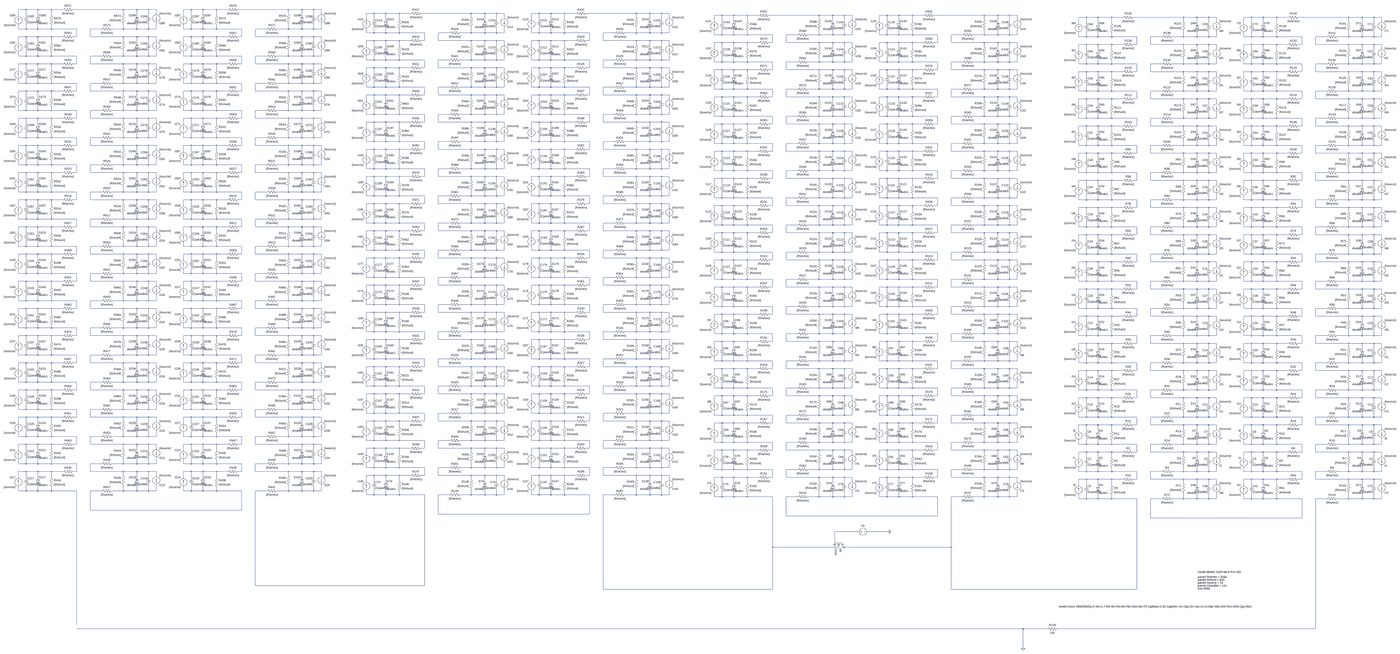
[diagram p0: schematic string-module-72cells-series.asc, whole sheet]
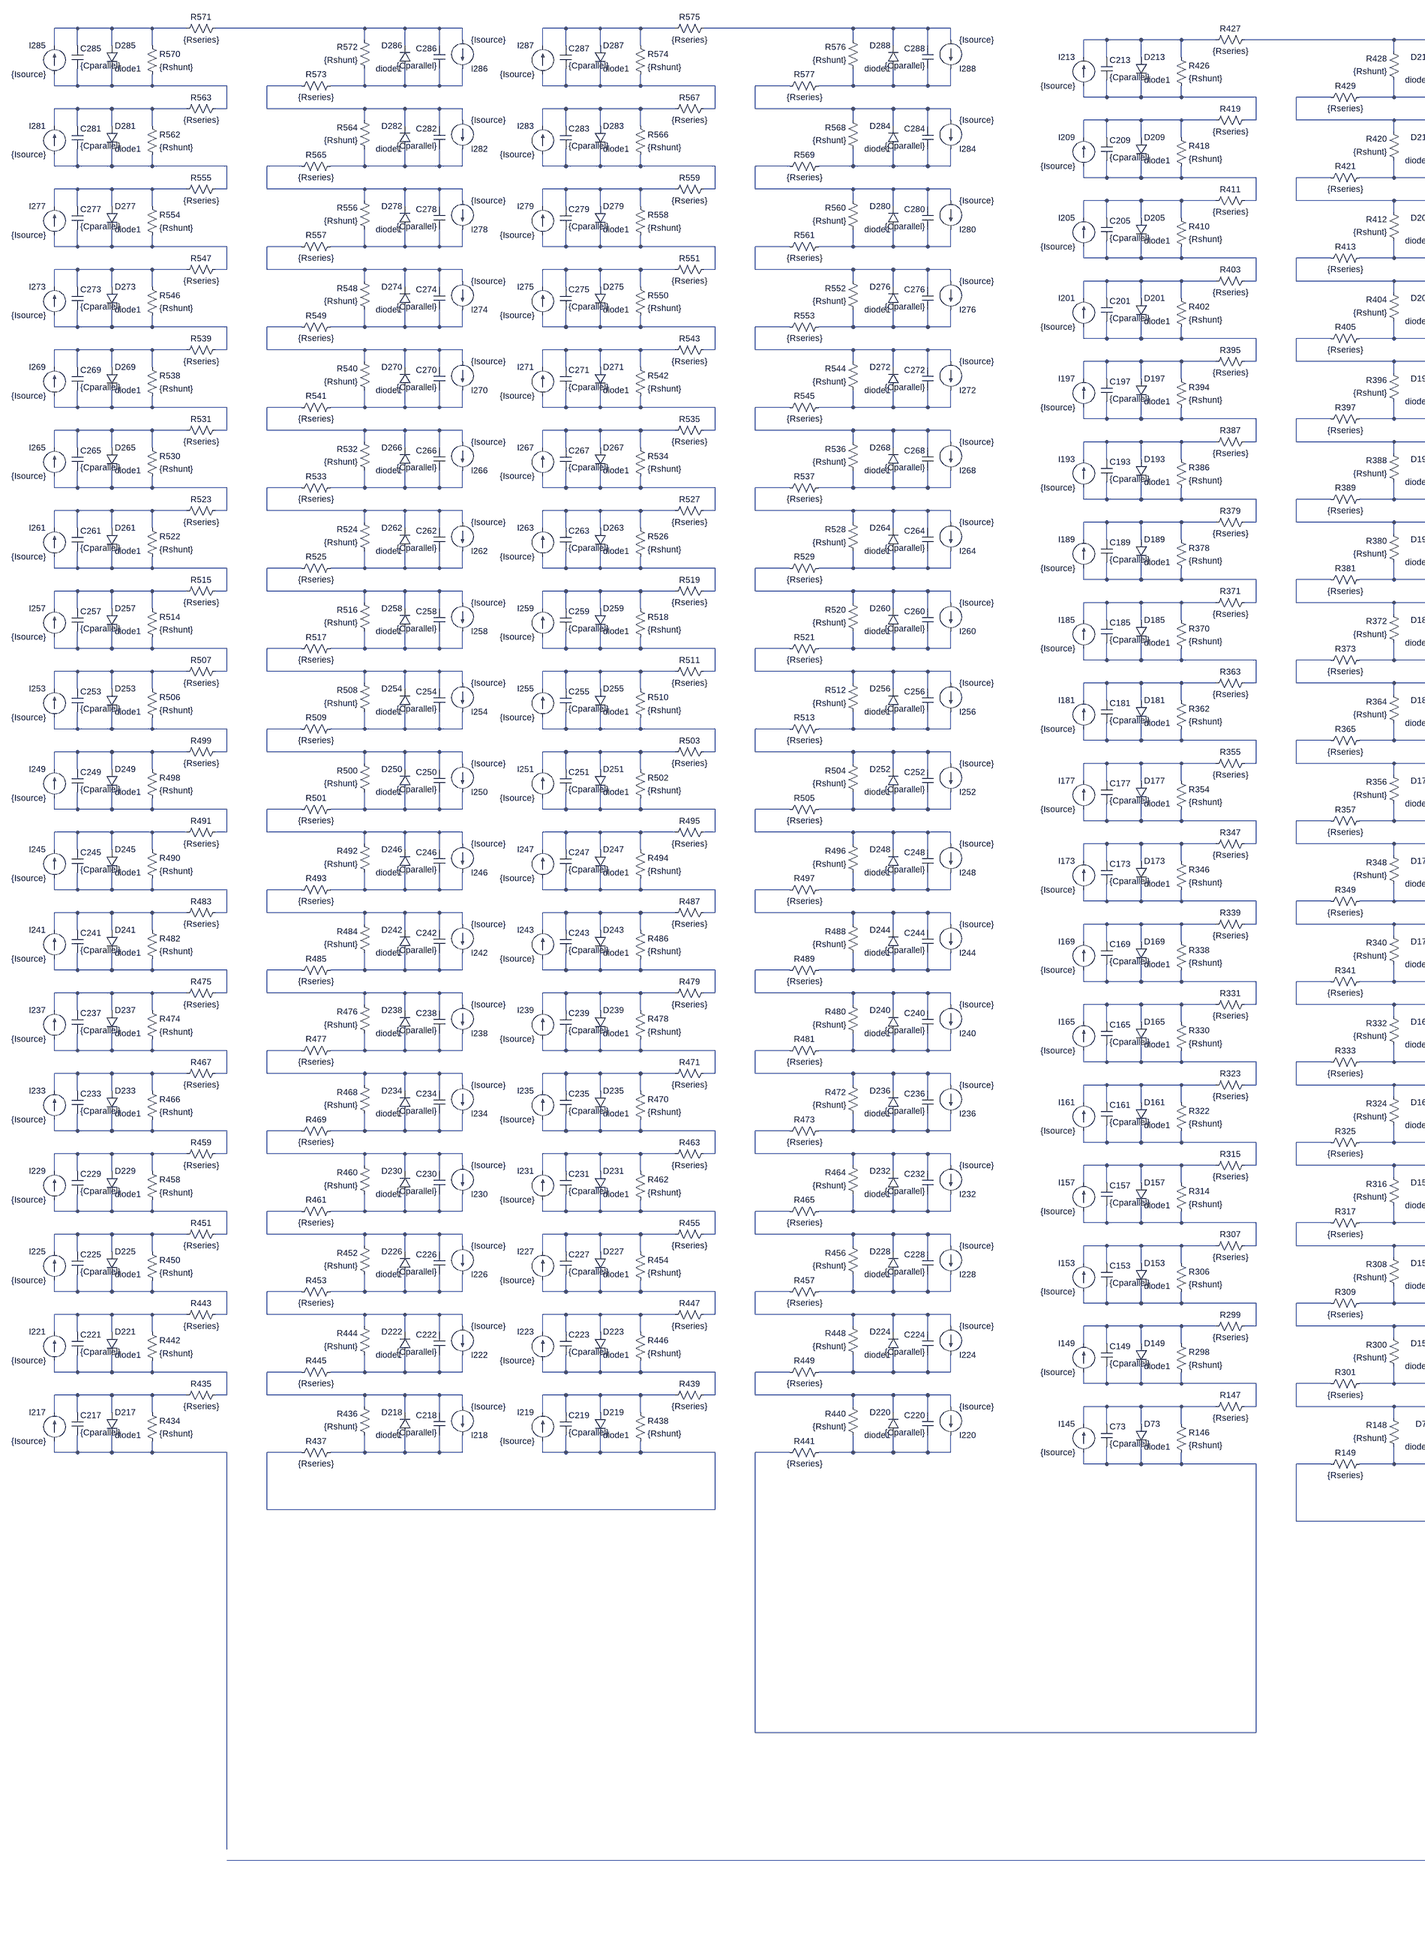
[diagram p1: schematic string-module-72cells-series.asc, part, row 1 of 1, column 1 of 3]
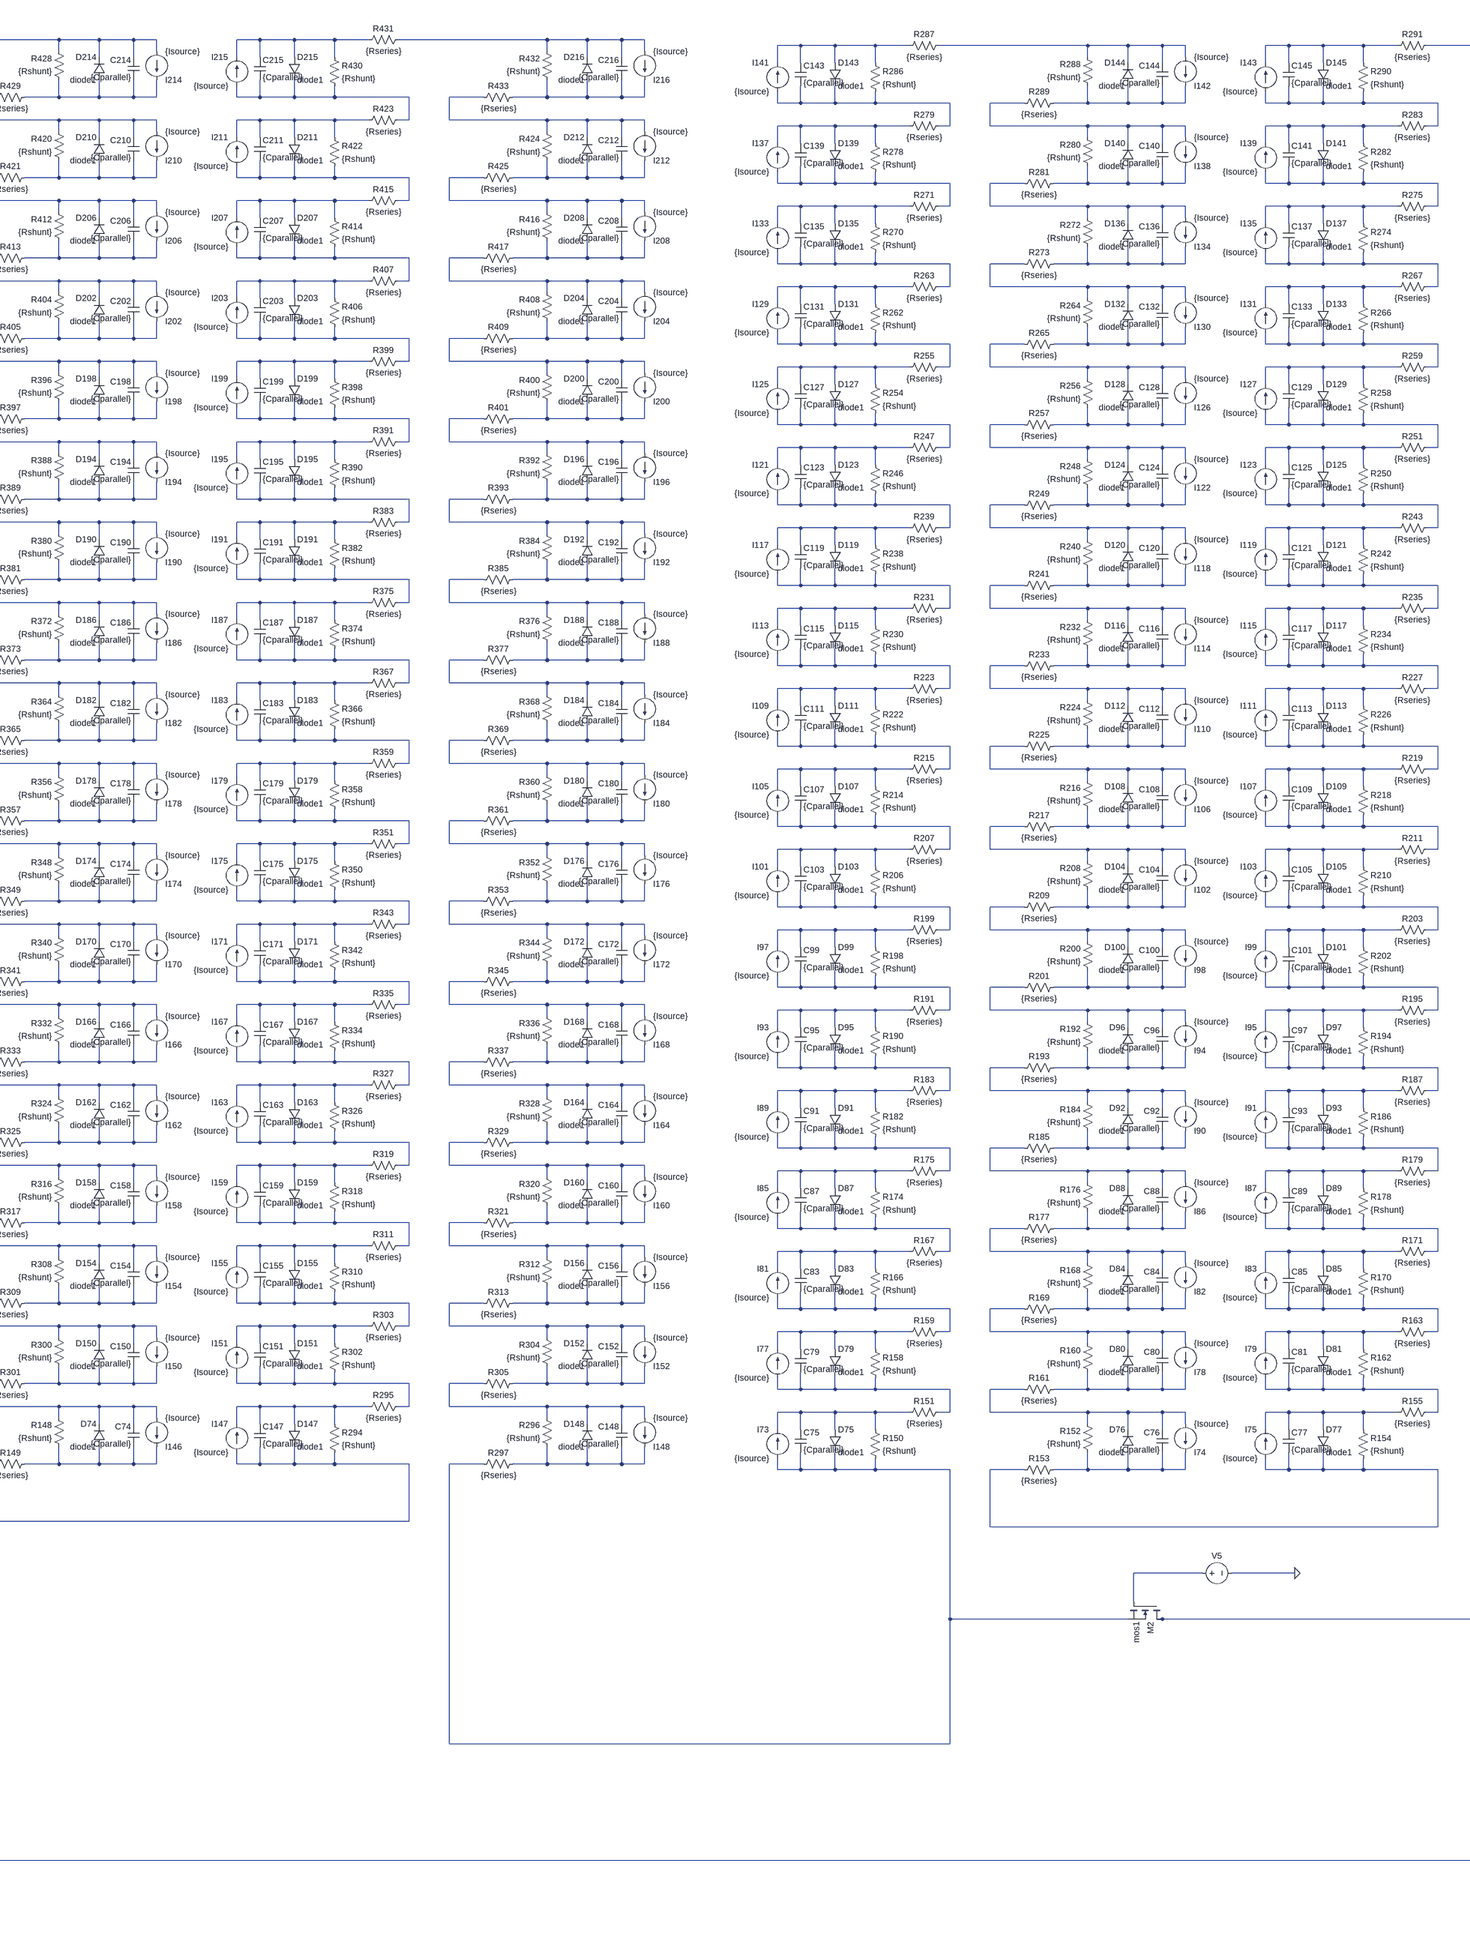
[diagram p2: schematic string-module-72cells-series.asc, part, row 1 of 1, column 2 of 3]
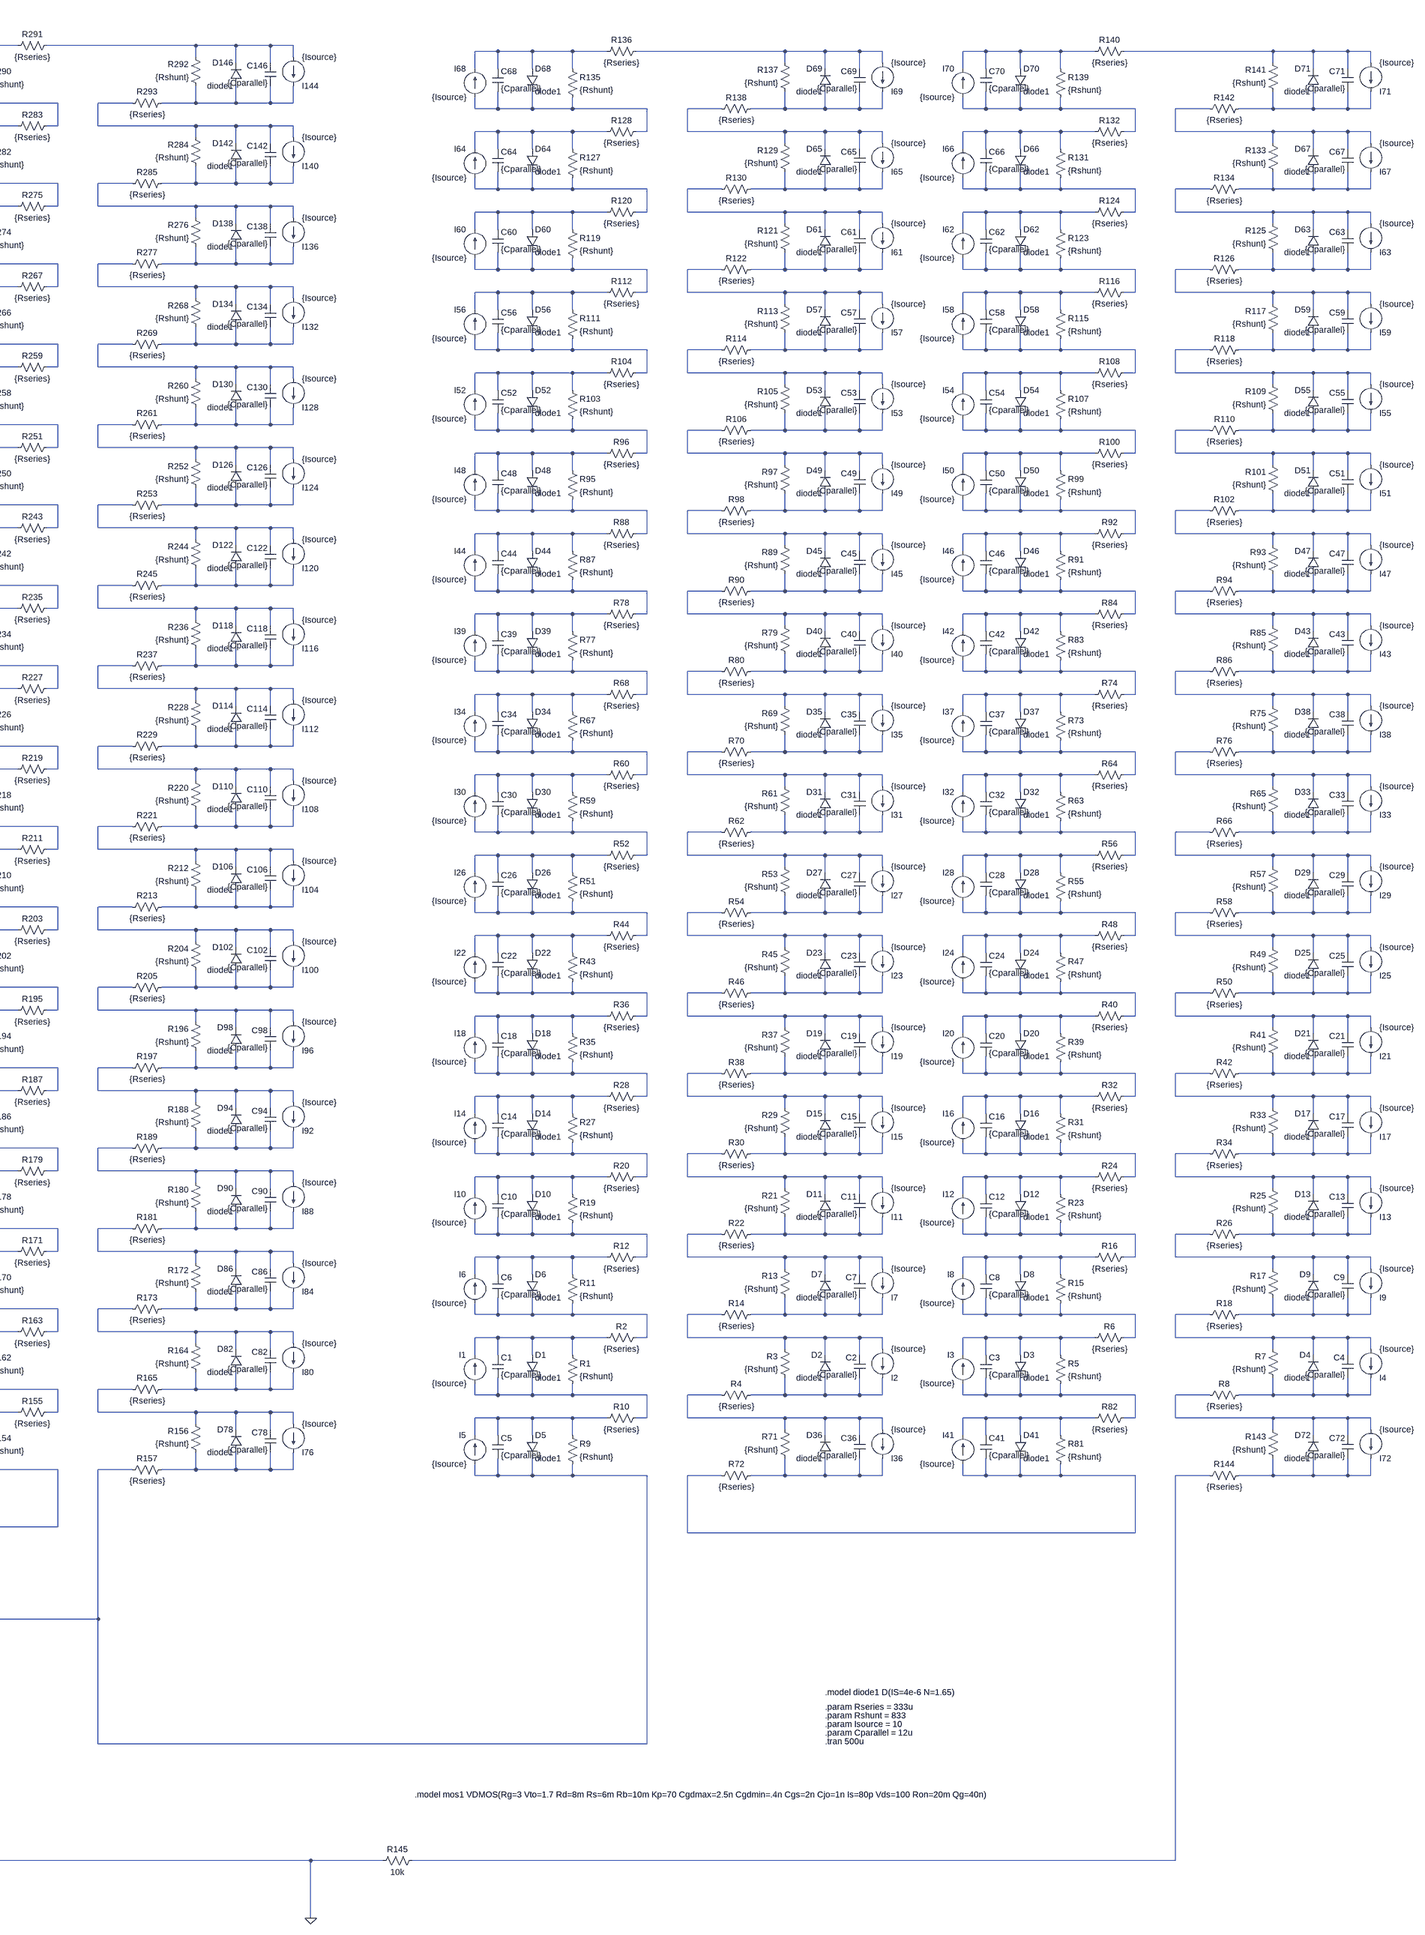
[diagram p3: schematic string-module-72cells-series.asc, part, row 1 of 1, column 3 of 3]
* string-module-72cells-series.asc
I5 N572 N559 {Isource}
C5 N559 N572 {Cparallel}
D5 N559 N572 diode1
R9 N559 N572 {Rshunt}
R10 N549 N559 {Rseries}
I36 N550 N575 {Isource}
C36 N575 N550 {Cparallel}
D36 N575 N550 diode1
R71 N575 N550 {Rshunt}
R72 N574 N575 {Rseries}
I41 N574 N560 {Isource}
C41 N560 N574 {Cparallel}
D41 N560 N574 diode1
R81 N560 N574 {Rshunt}
R82 N552 N560 {Rseries}
I72 N553 N577 {Isource}
C72 N577 N553 {Cparallel}
D72 N577 N553 diode1
R143 N577 N553 {Rshunt}
R144 N576 N577 {Rseries}
I1 N549 N527 {Isource}
C1 N527 N549 {Cparallel}
D1 N527 N549 diode1
R1 N527 N549 {Rshunt}
R2 N517 N527 {Rseries}
I2 N518 N551 {Isource}
C2 N551 N518 {Cparallel}
D2 N551 N518 diode1
R3 N551 N518 {Rshunt}
R4 N550 N551 {Rseries}
I3 N552 N528 {Isource}
C3 N528 N552 {Cparallel}
D3 N528 N552 diode1
R5 N528 N552 {Rshunt}
R6 N520 N528 {Rseries}
I4 N521 N554 {Isource}
C4 N554 N521 {Cparallel}
D4 N554 N521 diode1
R7 N554 N521 {Rshunt}
R8 N553 N554 {Rseries}
I6 N517 N495 {Isource}
C6 N495 N517 {Cparallel}
D6 N495 N517 diode1
R11 N495 N517 {Rshunt}
R12 N485 N495 {Rseries}
I7 N486 N519 {Isource}
C7 N519 N486 {Cparallel}
D7 N519 N486 diode1
R13 N519 N486 {Rshunt}
R14 N518 N519 {Rseries}
I8 N520 N496 {Isource}
C8 N496 N520 {Cparallel}
D8 N496 N520 diode1
R15 N496 N520 {Rshunt}
R16 N488 N496 {Rseries}
I9 N489 N522 {Isource}
C9 N522 N489 {Cparallel}
D9 N522 N489 diode1
R17 N522 N489 {Rshunt}
R18 N521 N522 {Rseries}
I10 N485 N463 {Isource}
C10 N463 N485 {Cparallel}
D10 N463 N485 diode1
R19 N463 N485 {Rshunt}
R20 N453 N463 {Rseries}
I11 N454 N487 {Isource}
C11 N487 N454 {Cparallel}
D11 N487 N454 diode1
R21 N487 N454 {Rshunt}
R22 N486 N487 {Rseries}
I12 N488 N464 {Isource}
C12 N464 N488 {Cparallel}
D12 N464 N488 diode1
R23 N464 N488 {Rshunt}
R24 N456 N464 {Rseries}
I13 N457 N490 {Isource}
C13 N490 N457 {Cparallel}
D13 N490 N457 diode1
R25 N490 N457 {Rshunt}
R26 N489 N490 {Rseries}
I14 N453 N431 {Isource}
C14 N431 N453 {Cparallel}
D14 N431 N453 diode1
R27 N431 N453 {Rshunt}
R28 N421 N431 {Rseries}
I15 N422 N455 {Isource}
C15 N455 N422 {Cparallel}
D15 N455 N422 diode1
R29 N455 N422 {Rshunt}
R30 N454 N455 {Rseries}
I16 N456 N432 {Isource}
C16 N432 N456 {Cparallel}
D16 N432 N456 diode1
R31 N432 N456 {Rshunt}
R32 N424 N432 {Rseries}
I17 N425 N458 {Isource}
C17 N458 N425 {Cparallel}
D17 N458 N425 diode1
R33 N458 N425 {Rshunt}
R34 N457 N458 {Rseries}
I18 N421 N399 {Isource}
C18 N399 N421 {Cparallel}
D18 N399 N421 diode1
R35 N399 N421 {Rshunt}
R36 N389 N399 {Rseries}
I19 N390 N423 {Isource}
C19 N423 N390 {Cparallel}
D19 N423 N390 diode1
R37 N423 N390 {Rshunt}
R38 N422 N423 {Rseries}
I20 N424 N400 {Isource}
C20 N400 N424 {Cparallel}
D20 N400 N424 diode1
R39 N400 N424 {Rshunt}
R40 N392 N400 {Rseries}
I21 N393 N426 {Isource}
C21 N426 N393 {Cparallel}
D21 N426 N393 diode1
R41 N426 N393 {Rshunt}
R42 N425 N426 {Rseries}
I22 N389 N367 {Isource}
C22 N367 N389 {Cparallel}
D22 N367 N389 diode1
R43 N367 N389 {Rshunt}
R44 N357 N367 {Rseries}
I23 N358 N391 {Isource}
C23 N391 N358 {Cparallel}
D23 N391 N358 diode1
R45 N391 N358 {Rshunt}
R46 N390 N391 {Rseries}
I24 N392 N368 {Isource}
C24 N368 N392 {Cparallel}
D24 N368 N392 diode1
R47 N368 N392 {Rshunt}
R48 N360 N368 {Rseries}
I25 N361 N394 {Isource}
C25 N394 N361 {Cparallel}
D25 N394 N361 diode1
R49 N394 N361 {Rshunt}
R50 N393 N394 {Rseries}
I26 N357 N335 {Isource}
C26 N335 N357 {Cparallel}
D26 N335 N357 diode1
R51 N335 N357 {Rshunt}
R52 N325 N335 {Rseries}
I27 N326 N359 {Isource}
C27 N359 N326 {Cparallel}
D27 N359 N326 diode1
R53 N359 N326 {Rshunt}
R54 N358 N359 {Rseries}
I28 N360 N336 {Isource}
C28 N336 N360 {Cparallel}
D28 N336 N360 diode1
R55 N336 N360 {Rshunt}
R56 N328 N336 {Rseries}
I29 N329 N362 {Isource}
C29 N362 N329 {Cparallel}
D29 N362 N329 diode1
R57 N362 N329 {Rshunt}
R58 N361 N362 {Rseries}
I30 N325 N303 {Isource}
C30 N303 N325 {Cparallel}
D30 N303 N325 diode1
R59 N303 N325 {Rshunt}
R60 N293 N303 {Rseries}
I31 N294 N327 {Isource}
C31 N327 N294 {Cparallel}
D31 N327 N294 diode1
R61 N327 N294 {Rshunt}
R62 N326 N327 {Rseries}
I32 N328 N304 {Isource}
C32 N304 N328 {Cparallel}
D32 N304 N328 diode1
R63 N304 N328 {Rshunt}
R64 N296 N304 {Rseries}
I33 N297 N330 {Isource}
C33 N330 N297 {Cparallel}
D33 N330 N297 diode1
R65 N330 N297 {Rshunt}
R66 N329 N330 {Rseries}
I34 N293 N271 {Isource}
C34 N271 N293 {Cparallel}
D34 N271 N293 diode1
R67 N271 N293 {Rshunt}
R68 N261 N271 {Rseries}
I35 N262 N295 {Isource}
C35 N295 N262 {Cparallel}
D35 N295 N262 diode1
R69 N295 N262 {Rshunt}
R70 N294 N295 {Rseries}
I37 N296 N272 {Isource}
C37 N272 N296 {Cparallel}
D37 N272 N296 diode1
R73 N272 N296 {Rshunt}
R74 N264 N272 {Rseries}
I38 N265 N298 {Isource}
C38 N298 N265 {Cparallel}
D38 N298 N265 diode1
R75 N298 N265 {Rshunt}
R76 N297 N298 {Rseries}
I39 N261 N239 {Isource}
C39 N239 N261 {Cparallel}
D39 N239 N261 diode1
R77 N239 N261 {Rshunt}
R78 N229 N239 {Rseries}
I40 N230 N263 {Isource}
C40 N263 N230 {Cparallel}
D40 N263 N230 diode1
R79 N263 N230 {Rshunt}
R80 N262 N263 {Rseries}
I42 N264 N240 {Isource}
C42 N240 N264 {Cparallel}
D42 N240 N264 diode1
R83 N240 N264 {Rshunt}
R84 N232 N240 {Rseries}
I43 N233 N266 {Isource}
C43 N266 N233 {Cparallel}
D43 N266 N233 diode1
R85 N266 N233 {Rshunt}
R86 N265 N266 {Rseries}
I44 N229 N207 {Isource}
C44 N207 N229 {Cparallel}
D44 N207 N229 diode1
R87 N207 N229 {Rshunt}
R88 N197 N207 {Rseries}
I45 N198 N231 {Isource}
C45 N231 N198 {Cparallel}
D45 N231 N198 diode1
R89 N231 N198 {Rshunt}
R90 N230 N231 {Rseries}
I46 N232 N208 {Isource}
C46 N208 N232 {Cparallel}
D46 N208 N232 diode1
R91 N208 N232 {Rshunt}
R92 N200 N208 {Rseries}
I47 N201 N234 {Isource}
C47 N234 N201 {Cparallel}
D47 N234 N201 diode1
R93 N234 N201 {Rshunt}
R94 N233 N234 {Rseries}
I48 N197 N175 {Isource}
C48 N175 N197 {Cparallel}
D48 N175 N197 diode1
R95 N175 N197 {Rshunt}
R96 N165 N175 {Rseries}
I49 N166 N199 {Isource}
C49 N199 N166 {Cparallel}
D49 N199 N166 diode1
R97 N199 N166 {Rshunt}
R98 N198 N199 {Rseries}
I50 N200 N176 {Isource}
C50 N176 N200 {Cparallel}
D50 N176 N200 diode1
R99 N176 N200 {Rshunt}
R100 N168 N176 {Rseries}
I51 N169 N202 {Isource}
C51 N202 N169 {Cparallel}
D51 N202 N169 diode1
R101 N202 N169 {Rshunt}
R102 N201 N202 {Rseries}
I52 N165 N143 {Isource}
C52 N143 N165 {Cparallel}
D52 N143 N165 diode1
R103 N143 N165 {Rshunt}
R104 N133 N143 {Rseries}
I53 N134 N167 {Isource}
C53 N167 N134 {Cparallel}
D53 N167 N134 diode1
R105 N167 N134 {Rshunt}
R106 N166 N167 {Rseries}
I54 N168 N144 {Isource}
C54 N144 N168 {Cparallel}
D54 N144 N168 diode1
R107 N144 N168 {Rshunt}
R108 N136 N144 {Rseries}
I55 N137 N170 {Isource}
C55 N170 N137 {Cparallel}
D55 N170 N137 diode1
R109 N170 N137 {Rshunt}
R110 N169 N170 {Rseries}
I56 N133 N111 {Isource}
C56 N111 N133 {Cparallel}
D56 N111 N133 diode1
R111 N111 N133 {Rshunt}
R112 N101 N111 {Rseries}
I57 N102 N135 {Isource}
C57 N135 N102 {Cparallel}
D57 N135 N102 diode1
R113 N135 N102 {Rshunt}
R114 N134 N135 {Rseries}
I58 N136 N112 {Isource}
C58 N112 N136 {Cparallel}
D58 N112 N136 diode1
R115 N112 N136 {Rshunt}
R116 N104 N112 {Rseries}
I59 N105 N138 {Isource}
C59 N138 N105 {Cparallel}
D59 N138 N105 diode1
R117 N138 N105 {Rshunt}
R118 N137 N138 {Rseries}
I60 N101 N079 {Isource}
C60 N079 N101 {Cparallel}
D60 N079 N101 diode1
R119 N079 N101 {Rshunt}
R120 N069 N079 {Rseries}
I61 N070 N103 {Isource}
C61 N103 N070 {Cparallel}
D61 N103 N070 diode1
R121 N103 N070 {Rshunt}
R122 N102 N103 {Rseries}
I62 N104 N080 {Isource}
C62 N080 N104 {Cparallel}
D62 N080 N104 diode1
R123 N080 N104 {Rshunt}
R124 N072 N080 {Rseries}
I63 N073 N106 {Isource}
C63 N106 N073 {Cparallel}
D63 N106 N073 diode1
R125 N106 N073 {Rshunt}
R126 N105 N106 {Rseries}
I64 N069 N047 {Isource}
C64 N047 N069 {Cparallel}
D64 N047 N069 diode1
R127 N047 N069 {Rshunt}
R128 N037 N047 {Rseries}
I65 N038 N071 {Isource}
C65 N071 N038 {Cparallel}
D65 N071 N038 diode1
R129 N071 N038 {Rshunt}
R130 N070 N071 {Rseries}
I66 N072 N048 {Isource}
C66 N048 N072 {Cparallel}
D66 N048 N072 diode1
R131 N048 N072 {Rshunt}
R132 N040 N048 {Rseries}
I67 N041 N074 {Isource}
C67 N074 N041 {Cparallel}
D67 N074 N041 diode1
R133 N074 N041 {Rshunt}
R134 N073 N074 {Rseries}
I68 N037 N013 {Isource}
C68 N013 N037 {Cparallel}
D68 N013 N037 diode1
R135 N013 N037 {Rshunt}
R136 N014 N013 {Rseries}
I69 N014 N039 {Isource}
C69 N039 N014 {Cparallel}
D69 N039 N014 diode1
R137 N039 N014 {Rshunt}
R138 N038 N039 {Rseries}
I70 N040 N015 {Isource}
C70 N015 N040 {Cparallel}
D70 N015 N040 diode1
R139 N015 N040 {Rshunt}
R140 N016 N015 {Rseries}
I71 N016 N042 {Isource}
C71 N042 N016 {Cparallel}
D71 N042 N016 diode1
R141 N042 N016 {Rshunt}
R142 N041 N042 {Rseries}
I73 N568 N557 {Isource}
C75 N557 N568 {Cparallel}
D75 N557 N568 diode1
R150 N557 N568 {Rshunt}
R151 N541 N557 {Rseries}
I74 N542 N571 {Isource}
C76 N571 N542 {Cparallel}
D76 N571 N542 diode1
R152 N571 N542 {Rshunt}
R153 N570 N571 {Rseries}
M2 N572 N578 N568 N568 mos1
V5 N578 0
I75 N570 N558 {Isource}
C77 N558 N570 {Cparallel}
D77 N558 N570 diode1
R154 N558 N570 {Rshunt}
R155 N544 N558 {Rseries}
I76 N545 N573 {Isource}
C78 N573 N545 {Cparallel}
D78 N573 N545 diode1
R156 N573 N545 {Rshunt}
R157 N572 N573 {Rseries}
I77 N541 N525 {Isource}
C79 N525 N541 {Cparallel}
D79 N525 N541 diode1
R158 N525 N541 {Rshunt}
R159 N509 N525 {Rseries}
I78 N510 N543 {Isource}
C80 N543 N510 {Cparallel}
D80 N543 N510 diode1
R160 N543 N510 {Rshunt}
R161 N542 N543 {Rseries}
I79 N544 N526 {Isource}
C81 N526 N544 {Cparallel}
D81 N526 N544 diode1
R162 N526 N544 {Rshunt}
R163 N512 N526 {Rseries}
I80 N513 N546 {Isource}
C82 N546 N513 {Cparallel}
D82 N546 N513 diode1
R164 N546 N513 {Rshunt}
R165 N545 N546 {Rseries}
I81 N509 N493 {Isource}
C83 N493 N509 {Cparallel}
D83 N493 N509 diode1
R166 N493 N509 {Rshunt}
R167 N477 N493 {Rseries}
I82 N478 N511 {Isource}
C84 N511 N478 {Cparallel}
D84 N511 N478 diode1
R168 N511 N478 {Rshunt}
R169 N510 N511 {Rseries}
I83 N512 N494 {Isource}
C85 N494 N512 {Cparallel}
D85 N494 N512 diode1
R170 N494 N512 {Rshunt}
R171 N480 N494 {Rseries}
I84 N481 N514 {Isource}
C86 N514 N481 {Cparallel}
D86 N514 N481 diode1
R172 N514 N481 {Rshunt}
R173 N513 N514 {Rseries}
I85 N477 N461 {Isource}
C87 N461 N477 {Cparallel}
D87 N461 N477 diode1
R174 N461 N477 {Rshunt}
R175 N445 N461 {Rseries}
I86 N446 N479 {Isource}
C88 N479 N446 {Cparallel}
D88 N479 N446 diode1
R176 N479 N446 {Rshunt}
R177 N478 N479 {Rseries}
I87 N480 N462 {Isource}
C89 N462 N480 {Cparallel}
D89 N462 N480 diode1
R178 N462 N480 {Rshunt}
R179 N448 N462 {Rseries}
I88 N449 N482 {Isource}
C90 N482 N449 {Cparallel}
D90 N482 N449 diode1
R180 N482 N449 {Rshunt}
R181 N481 N482 {Rseries}
I89 N445 N429 {Isource}
C91 N429 N445 {Cparallel}
D91 N429 N445 diode1
R182 N429 N445 {Rshunt}
R183 N413 N429 {Rseries}
I90 N414 N447 {Isource}
C92 N447 N414 {Cparallel}
D92 N447 N414 diode1
R184 N447 N414 {Rshunt}
R185 N446 N447 {Rseries}
I91 N448 N430 {Isource}
C93 N430 N448 {Cparallel}
D93 N430 N448 diode1
R186 N430 N448 {Rshunt}
R187 N416 N430 {Rseries}
I92 N417 N450 {Isource}
C94 N450 N417 {Cparallel}
D94 N450 N417 diode1
R188 N450 N417 {Rshunt}
R189 N449 N450 {Rseries}
I93 N413 N397 {Isource}
C95 N397 N413 {Cparallel}
D95 N397 N413 diode1
R190 N397 N413 {Rshunt}
R191 N381 N397 {Rseries}
I94 N382 N415 {Isource}
C96 N415 N382 {Cparallel}
D96 N415 N382 diode1
R192 N415 N382 {Rshunt}
R193 N414 N415 {Rseries}
I95 N416 N398 {Isource}
C97 N398 N416 {Cparallel}
D97 N398 N416 diode1
R194 N398 N416 {Rshunt}
R195 N384 N398 {Rseries}
I96 N385 N418 {Isource}
C98 N418 N385 {Cparallel}
D98 N418 N385 diode1
R196 N418 N385 {Rshunt}
R197 N417 N418 {Rseries}
I97 N381 N365 {Isource}
C99 N365 N381 {Cparallel}
D99 N365 N381 diode1
R198 N365 N381 {Rshunt}
R199 N349 N365 {Rseries}
I98 N350 N383 {Isource}
C100 N383 N350 {Cparallel}
D100 N383 N350 diode1
R200 N383 N350 {Rshunt}
R201 N382 N383 {Rseries}
I99 N384 N366 {Isource}
C101 N366 N384 {Cparallel}
D101 N366 N384 diode1
R202 N366 N384 {Rshunt}
R203 N352 N366 {Rseries}
I100 N353 N386 {Isource}
C102 N386 N353 {Cparallel}
D102 N386 N353 diode1
R204 N386 N353 {Rshunt}
R205 N385 N386 {Rseries}
I101 N349 N333 {Isource}
C103 N333 N349 {Cparallel}
D103 N333 N349 diode1
R206 N333 N349 {Rshunt}
R207 N317 N333 {Rseries}
I102 N318 N351 {Isource}
C104 N351 N318 {Cparallel}
D104 N351 N318 diode1
R208 N351 N318 {Rshunt}
R209 N350 N351 {Rseries}
I103 N352 N334 {Isource}
C105 N334 N352 {Cparallel}
D105 N334 N352 diode1
R210 N334 N352 {Rshunt}
R211 N320 N334 {Rseries}
I104 N321 N354 {Isource}
C106 N354 N321 {Cparallel}
D106 N354 N321 diode1
R212 N354 N321 {Rshunt}
R213 N353 N354 {Rseries}
I105 N317 N301 {Isource}
C107 N301 N317 {Cparallel}
D107 N301 N317 diode1
R214 N301 N317 {Rshunt}
R215 N285 N301 {Rseries}
I106 N286 N319 {Isource}
C108 N319 N286 {Cparallel}
D108 N319 N286 diode1
R216 N319 N286 {Rshunt}
R217 N318 N319 {Rseries}
I107 N320 N302 {Isource}
C109 N302 N320 {Cparallel}
D109 N302 N320 diode1
R218 N302 N320 {Rshunt}
R219 N288 N302 {Rseries}
I108 N289 N322 {Isource}
C110 N322 N289 {Cparallel}
D110 N322 N289 diode1
R220 N322 N289 {Rshunt}
R221 N321 N322 {Rseries}
I109 N285 N269 {Isource}
C111 N269 N285 {Cparallel}
D111 N269 N285 diode1
R222 N269 N285 {Rshunt}
R223 N253 N269 {Rseries}
I110 N254 N287 {Isource}
C112 N287 N254 {Cparallel}
D112 N287 N254 diode1
R224 N287 N254 {Rshunt}
R225 N286 N287 {Rseries}
I111 N288 N270 {Isource}
C113 N270 N288 {Cparallel}
D113 N270 N288 diode1
R226 N270 N288 {Rshunt}
R227 N256 N270 {Rseries}
I112 N257 N290 {Isource}
C114 N290 N257 {Cparallel}
D114 N290 N257 diode1
R228 N290 N257 {Rshunt}
R229 N289 N290 {Rseries}
I113 N253 N237 {Isource}
C115 N237 N253 {Cparallel}
D115 N237 N253 diode1
R230 N237 N253 {Rshunt}
R231 N221 N237 {Rseries}
I114 N222 N255 {Isource}
C116 N255 N222 {Cparallel}
D116 N255 N222 diode1
R232 N255 N222 {Rshunt}
R233 N254 N255 {Rseries}
I115 N256 N238 {Isource}
C117 N238 N256 {Cparallel}
D117 N238 N256 diode1
R234 N238 N256 {Rshunt}
R235 N224 N238 {Rseries}
I116 N225 N258 {Isource}
C118 N258 N225 {Cparallel}
D118 N258 N225 diode1
R236 N258 N225 {Rshunt}
R237 N257 N258 {Rseries}
I117 N221 N205 {Isource}
C119 N205 N221 {Cparallel}
D119 N205 N221 diode1
R238 N205 N221 {Rshunt}
R239 N189 N205 {Rseries}
I118 N190 N223 {Isource}
C120 N223 N190 {Cparallel}
D120 N223 N190 diode1
R240 N223 N190 {Rshunt}
R241 N222 N223 {Rseries}
I119 N224 N206 {Isource}
C121 N206 N224 {Cparallel}
D121 N206 N224 diode1
R242 N206 N224 {Rshunt}
R243 N192 N206 {Rseries}
I120 N193 N226 {Isource}
C122 N226 N193 {Cparallel}
D122 N226 N193 diode1
R244 N226 N193 {Rshunt}
R245 N225 N226 {Rseries}
I121 N189 N173 {Isource}
C123 N173 N189 {Cparallel}
D123 N173 N189 diode1
R246 N173 N189 {Rshunt}
R247 N157 N173 {Rseries}
I122 N158 N191 {Isource}
C124 N191 N158 {Cparallel}
D124 N191 N158 diode1
R248 N191 N158 {Rshunt}
R249 N190 N191 {Rseries}
I123 N192 N174 {Isource}
C125 N174 N192 {Cparallel}
D125 N174 N192 diode1
R250 N174 N192 {Rshunt}
R251 N160 N174 {Rseries}
I124 N161 N194 {Isource}
C126 N194 N161 {Cparallel}
D126 N194 N161 diode1
R252 N194 N161 {Rshunt}
R253 N193 N194 {Rseries}
I125 N157 N141 {Isource}
C127 N141 N157 {Cparallel}
D127 N141 N157 diode1
R254 N141 N157 {Rshunt}
R255 N125 N141 {Rseries}
I126 N126 N159 {Isource}
C128 N159 N126 {Cparallel}
D128 N159 N126 diode1
R256 N159 N126 {Rshunt}
R257 N158 N159 {Rseries}
I127 N160 N142 {Isource}
C129 N142 N160 {Cparallel}
D129 N142 N160 diode1
R258 N142 N160 {Rshunt}
R259 N128 N142 {Rseries}
I128 N129 N162 {Isource}
C130 N162 N129 {Cparallel}
D130 N162 N129 diode1
R260 N162 N129 {Rshunt}
R261 N161 N162 {Rseries}
I129 N125 N109 {Isource}
C131 N109 N125 {Cparallel}
D131 N109 N125 diode1
R262 N109 N125 {Rshunt}
R263 N093 N109 {Rseries}
I130 N094 N127 {Isource}
C132 N127 N094 {Cparallel}
D132 N127 N094 diode1
R264 N127 N094 {Rshunt}
R265 N126 N127 {Rseries}
I131 N128 N110 {Isource}
C133 N110 N128 {Cparallel}
D133 N110 N128 diode1
R266 N110 N128 {Rshunt}
R267 N096 N110 {Rseries}
I132 N097 N130 {Isource}
C134 N130 N097 {Cparallel}
D134 N130 N097 diode1
R268 N130 N097 {Rshunt}
R269 N129 N130 {Rseries}
I133 N093 N077 {Isource}
C135 N077 N093 {Cparallel}
D135 N077 N093 diode1
R270 N077 N093 {Rshunt}
R271 N061 N077 {Rseries}
I134 N062 N095 {Isource}
C136 N095 N062 {Cparallel}
D136 N095 N062 diode1
R272 N095 N062 {Rshunt}
R273 N094 N095 {Rseries}
I135 N096 N078 {Isource}
C137 N078 N096 {Cparallel}
D137 N078 N096 diode1
R274 N078 N096 {Rshunt}
R275 N064 N078 {Rseries}
I136 N065 N098 {Isource}
C138 N098 N065 {Cparallel}
D138 N098 N065 diode1
R276 N098 N065 {Rshunt}
R277 N097 N098 {Rseries}
I137 N061 N045 {Isource}
C139 N045 N061 {Cparallel}
D139 N045 N061 diode1
R278 N045 N061 {Rshunt}
R279 N029 N045 {Rseries}
I138 N030 N063 {Isource}
C140 N063 N030 {Cparallel}
D140 N063 N030 diode1
R280 N063 N030 {Rshunt}
R281 N062 N063 {Rseries}
I139 N064 N046 {Isource}
C141 N046 N064 {Cparallel}
D141 N046 N064 diode1
R282 N046 N064 {Rshunt}
R283 N032 N046 {Rseries}
I140 N033 N066 {Isource}
C142 N066 N033 {Cparallel}
D142 N066 N033 diode1
R284 N066 N033 {Rshunt}
R285 N065 N066 {Rseries}
I141 N029 N009 {Isource}
C143 N009 N029 {Cparallel}
D143 N009 N029 diode1
R286 N009 N029 {Rshunt}
R287 N010 N009 {Rseries}
I142 N010 N031 {Isource}
C144 N031 N010 {Cparallel}
D144 N031 N010 diode1
R288 N031 N010 {Rshunt}
R289 N030 N031 {Rseries}
I143 N032 N011 {Isource}
C145 N011 N032 {Cparallel}
D145 N011 N032 diode1
R290 N011 N032 {Rshunt}
R291 N012 N011 {Rseries}
I144 N012 N034 {Isource}
C146 N034 N012 {Cparallel}
D146 N034 N012 diode1
R292 N034 N012 {Rshunt}
R293 N033 N034 {Rseries}
R145 N576 0 10k
I145 N564 N555 {Isource}
C73 N555 N564 {Cparallel}
D73 N555 N564 diode1
R146 N555 N564 {Rshunt}
R147 N535 N555 {Rseries}
I146 N536 N567 {Isource}
C74 N567 N536 {Cparallel}
D74 N567 N536 diode1
R148 N567 N536 {Rshunt}
R149 N566 N567 {Rseries}
I147 N566 N556 {Isource}
C147 N556 N566 {Cparallel}
D147 N556 N566 diode1
R294 N556 N566 {Rshunt}
R295 N538 N556 {Rseries}
I148 N539 N569 {Isource}
C148 N569 N539 {Cparallel}
D148 N569 N539 diode1
R296 N569 N539 {Rshunt}
R297 N568 N569 {Rseries}
I149 N535 N523 {Isource}
C149 N523 N535 {Cparallel}
D149 N523 N535 diode1
R298 N523 N535 {Rshunt}
R299 N503 N523 {Rseries}
I150 N504 N537 {Isource}
C150 N537 N504 {Cparallel}
D150 N537 N504 diode1
R300 N537 N504 {Rshunt}
R301 N536 N537 {Rseries}
I151 N538 N524 {Isource}
C151 N524 N538 {Cparallel}
D151 N524 N538 diode1
R302 N524 N538 {Rshunt}
R303 N506 N524 {Rseries}
I152 N507 N540 {Isource}
C152 N540 N507 {Cparallel}
D152 N540 N507 diode1
R304 N540 N507 {Rshunt}
R305 N539 N540 {Rseries}
I153 N503 N491 {Isource}
C153 N491 N503 {Cparallel}
D153 N491 N503 diode1
R306 N491 N503 {Rshunt}
R307 N471 N491 {Rseries}
I154 N472 N505 {Isource}
C154 N505 N472 {Cparallel}
D154 N505 N472 diode1
R308 N505 N472 {Rshunt}
R309 N504 N505 {Rseries}
I155 N506 N492 {Isource}
C155 N492 N506 {Cparallel}
D155 N492 N506 diode1
R310 N492 N506 {Rshunt}
R311 N474 N492 {Rseries}
I156 N475 N508 {Isource}
C156 N508 N475 {Cparallel}
D156 N508 N475 diode1
R312 N508 N475 {Rshunt}
R313 N507 N508 {Rseries}
I157 N471 N459 {Isource}
C157 N459 N471 {Cparallel}
D157 N459 N471 diode1
R314 N459 N471 {Rshunt}
R315 N439 N459 {Rseries}
I158 N440 N473 {Isource}
C158 N473 N440 {Cparallel}
D158 N473 N440 diode1
R316 N473 N440 {Rshunt}
R317 N472 N473 {Rseries}
I159 N474 N460 {Isource}
C159 N460 N474 {Cparallel}
D159 N460 N474 diode1
R318 N460 N474 {Rshunt}
R319 N442 N460 {Rseries}
I160 N443 N476 {Isource}
C160 N476 N443 {Cparallel}
D160 N476 N443 diode1
R320 N476 N443 {Rshunt}
R321 N475 N476 {Rseries}
I161 N439 N427 {Isource}
C161 N427 N439 {Cparallel}
D161 N427 N439 diode1
R322 N427 N439 {Rshunt}
R323 N407 N427 {Rseries}
I162 N408 N441 {Isource}
C162 N441 N408 {Cparallel}
D162 N441 N408 diode1
R324 N441 N408 {Rshunt}
R325 N440 N441 {Rseries}
I163 N442 N428 {Isource}
C163 N428 N442 {Cparallel}
D163 N428 N442 diode1
R326 N428 N442 {Rshunt}
R327 N410 N428 {Rseries}
I164 N411 N444 {Isource}
C164 N444 N411 {Cparallel}
D164 N444 N411 diode1
R328 N444 N411 {Rshunt}
R329 N443 N444 {Rseries}
I165 N407 N395 {Isource}
C165 N395 N407 {Cparallel}
D165 N395 N407 diode1
R330 N395 N407 {Rshunt}
R331 N375 N395 {Rseries}
I166 N376 N409 {Isource}
C166 N409 N376 {Cparallel}
D166 N409 N376 diode1
R332 N409 N376 {Rshunt}
R333 N408 N409 {Rseries}
I167 N410 N396 {Isource}
C167 N396 N410 {Cparallel}
D167 N396 N410 diode1
R334 N396 N410 {Rshunt}
R335 N378 N396 {Rseries}
I168 N379 N412 {Isource}
C168 N412 N379 {Cparallel}
D168 N412 N379 diode1
R336 N412 N379 {Rshunt}
R337 N411 N412 {Rseries}
I169 N375 N363 {Isource}
C169 N363 N375 {Cparallel}
D169 N363 N375 diode1
R338 N363 N375 {Rshunt}
R339 N343 N363 {Rseries}
I170 N344 N377 {Isource}
C170 N377 N344 {Cparallel}
D170 N377 N344 diode1
R340 N377 N344 {Rshunt}
R341 N376 N377 {Rseries}
I171 N378 N364 {Isource}
C171 N364 N378 {Cparallel}
D171 N364 N378 diode1
R342 N364 N378 {Rshunt}
R343 N346 N364 {Rseries}
I172 N347 N380 {Isource}
C172 N380 N347 {Cparallel}
D172 N380 N347 diode1
R344 N380 N347 {Rshunt}
R345 N379 N380 {Rseries}
I173 N343 N331 {Isource}
C173 N331 N343 {Cparallel}
D173 N331 N343 diode1
R346 N331 N343 {Rshunt}
R347 N311 N331 {Rseries}
I174 N312 N345 {Isource}
C174 N345 N312 {Cparallel}
D174 N345 N312 diode1
R348 N345 N312 {Rshunt}
R349 N344 N345 {Rseries}
I175 N346 N332 {Isource}
C175 N332 N346 {Cparallel}
D175 N332 N346 diode1
R350 N332 N346 {Rshunt}
R351 N314 N332 {Rseries}
I176 N315 N348 {Isource}
C176 N348 N315 {Cparallel}
D176 N348 N315 diode1
R352 N348 N315 {Rshunt}
R353 N347 N348 {Rseries}
I177 N311 N299 {Isource}
C177 N299 N311 {Cparallel}
D177 N299 N311 diode1
R354 N299 N311 {Rshunt}
R355 N279 N299 {Rseries}
I178 N280 N313 {Isource}
C178 N313 N280 {Cparallel}
D178 N313 N280 diode1
R356 N313 N280 {Rshunt}
R357 N312 N313 {Rseries}
I179 N314 N300 {Isource}
C179 N300 N314 {Cparallel}
D179 N300 N314 diode1
R358 N300 N314 {Rshunt}
R359 N282 N300 {Rseries}
I180 N283 N316 {Isource}
C180 N316 N283 {Cparallel}
D180 N316 N283 diode1
R360 N316 N283 {Rshunt}
R361 N315 N316 {Rseries}
I181 N279 N267 {Isource}
C181 N267 N279 {Cparallel}
D181 N267 N279 diode1
R362 N267 N279 {Rshunt}
R363 N247 N267 {Rseries}
I182 N248 N281 {Isource}
C182 N281 N248 {Cparallel}
D182 N281 N248 diode1
R364 N281 N248 {Rshunt}
R365 N280 N281 {Rseries}
I183 N282 N268 {Isource}
C183 N268 N282 {Cparallel}
D183 N268 N282 diode1
R366 N268 N282 {Rshunt}
R367 N250 N268 {Rseries}
I184 N251 N284 {Isource}
C184 N284 N251 {Cparallel}
D184 N284 N251 diode1
R368 N284 N251 {Rshunt}
R369 N283 N284 {Rseries}
I185 N247 N235 {Isource}
C185 N235 N247 {Cparallel}
D185 N235 N247 diode1
R370 N235 N247 {Rshunt}
R371 N215 N235 {Rseries}
I186 N216 N249 {Isource}
C186 N249 N216 {Cparallel}
D186 N249 N216 diode1
R372 N249 N216 {Rshunt}
R373 N248 N249 {Rseries}
I187 N250 N236 {Isource}
C187 N236 N250 {Cparallel}
D187 N236 N250 diode1
R374 N236 N250 {Rshunt}
R375 N218 N236 {Rseries}
I188 N219 N252 {Isource}
C188 N252 N219 {Cparallel}
D188 N252 N219 diode1
R376 N252 N219 {Rshunt}
R377 N251 N252 {Rseries}
I189 N215 N203 {Isource}
C189 N203 N215 {Cparallel}
D189 N203 N215 diode1
R378 N203 N215 {Rshunt}
R379 N183 N203 {Rseries}
I190 N184 N217 {Isource}
C190 N217 N184 {Cparallel}
D190 N217 N184 diode1
R380 N217 N184 {Rshunt}
R381 N216 N217 {Rseries}
I191 N218 N204 {Isource}
C191 N204 N218 {Cparallel}
D191 N204 N218 diode1
R382 N204 N218 {Rshunt}
R383 N186 N204 {Rseries}
I192 N187 N220 {Isource}
C192 N220 N187 {Cparallel}
D192 N220 N187 diode1
R384 N220 N187 {Rshunt}
R385 N219 N220 {Rseries}
I193 N183 N171 {Isource}
C193 N171 N183 {Cparallel}
D193 N171 N183 diode1
R386 N171 N183 {Rshunt}
R387 N151 N171 {Rseries}
I194 N152 N185 {Isource}
C194 N185 N152 {Cparallel}
D194 N185 N152 diode1
R388 N185 N152 {Rshunt}
R389 N184 N185 {Rseries}
I195 N186 N172 {Isource}
C195 N172 N186 {Cparallel}
D195 N172 N186 diode1
R390 N172 N186 {Rshunt}
R391 N154 N172 {Rseries}
I196 N155 N188 {Isource}
C196 N188 N155 {Cparallel}
D196 N188 N155 diode1
R392 N188 N155 {Rshunt}
R393 N187 N188 {Rseries}
I197 N151 N139 {Isource}
C197 N139 N151 {Cparallel}
D197 N139 N151 diode1
R394 N139 N151 {Rshunt}
R395 N119 N139 {Rseries}
I198 N120 N153 {Isource}
C198 N153 N120 {Cparallel}
D198 N153 N120 diode1
R396 N153 N120 {Rshunt}
R397 N152 N153 {Rseries}
I199 N154 N140 {Isource}
C199 N140 N154 {Cparallel}
D199 N140 N154 diode1
R398 N140 N154 {Rshunt}
R399 N122 N140 {Rseries}
I200 N123 N156 {Isource}
C200 N156 N123 {Cparallel}
D200 N156 N123 diode1
R400 N156 N123 {Rshunt}
R401 N155 N156 {Rseries}
I201 N119 N107 {Isource}
C201 N107 N119 {Cparallel}
D201 N107 N119 diode1
R402 N107 N119 {Rshunt}
R403 N087 N107 {Rseries}
I202 N088 N121 {Isource}
C202 N121 N088 {Cparallel}
D202 N121 N088 diode1
R404 N121 N088 {Rshunt}
R405 N120 N121 {Rseries}
I203 N122 N108 {Isource}
C203 N108 N122 {Cparallel}
D203 N108 N122 diode1
R406 N108 N122 {Rshunt}
R407 N090 N108 {Rseries}
I204 N091 N124 {Isource}
C204 N124 N091 {Cparallel}
D204 N124 N091 diode1
R408 N124 N091 {Rshunt}
R409 N123 N124 {Rseries}
I205 N087 N075 {Isource}
C205 N075 N087 {Cparallel}
D205 N075 N087 diode1
R410 N075 N087 {Rshunt}
R411 N055 N075 {Rseries}
I206 N056 N089 {Isource}
C206 N089 N056 {Cparallel}
D206 N089 N056 diode1
R412 N089 N056 {Rshunt}
R413 N088 N089 {Rseries}
I207 N090 N076 {Isource}
C207 N076 N090 {Cparallel}
D207 N076 N090 diode1
R414 N076 N090 {Rshunt}
R415 N058 N076 {Rseries}
I208 N059 N092 {Isource}
C208 N092 N059 {Cparallel}
D208 N092 N059 diode1
R416 N092 N059 {Rshunt}
R417 N091 N092 {Rseries}
I209 N055 N043 {Isource}
C209 N043 N055 {Cparallel}
D209 N043 N055 diode1
R418 N043 N055 {Rshunt}
R419 N023 N043 {Rseries}
I210 N024 N057 {Isource}
C210 N057 N024 {Cparallel}
D210 N057 N024 diode1
R420 N057 N024 {Rshunt}
R421 N056 N057 {Rseries}
I211 N058 N044 {Isource}
C211 N044 N058 {Cparallel}
D211 N044 N058 diode1
R422 N044 N058 {Rshunt}
R423 N026 N044 {Rseries}
I212 N027 N060 {Isource}
C212 N060 N027 {Cparallel}
D212 N060 N027 diode1
R424 N060 N027 {Rshunt}
R425 N059 N060 {Rseries}
I213 N023 N005 {Isource}
C213 N005 N023 {Cparallel}
D213 N005 N023 diode1
R426 N005 N023 {Rshunt}
R427 N006 N005 {Rseries}
I214 N006 N025 {Isource}
C214 N025 N006 {Cparallel}
D214 N025 N006 diode1
R428 N025 N006 {Rshunt}
R429 N024 N025 {Rseries}
I215 N026 N007 {Isource}
C215 N007 N026 {Cparallel}
D215 N007 N026 diode1
R430 N007 N026 {Rshunt}
R431 N008 N007 {Rseries}
I216 N008 N028 {Isource}
C216 N028 N008 {Cparallel}
D216 N028 N008 diode1
R432 N028 N008 {Rshunt}
R433 N027 N028 {Rseries}
I217 N561 N547 {Isource}
C217 N547 N561 {Cparallel}
D217 N547 N561 diode1
R434 N547 N561 {Rshunt}
R435 N529 N547 {Rseries}
I218 N530 N563 {Isource}
C218 N563 N530 {Cparallel}
D218 N563 N530 diode1
R436 N563 N530 {Rshunt}
R437 N562 N563 {Rseries}
I219 N562 N548 {Isource}
C219 N548 N562 {Cparallel}
D219 N548 N562 diode1
R438 N548 N562 {Rshunt}
R439 N532 N548 {Rseries}
I220 N533 N565 {Isource}
C220 N565 N533 {Cparallel}
D220 N565 N533 diode1
R440 N565 N533 {Rshunt}
R441 N564 N565 {Rseries}
I221 N529 N515 {Isource}
C221 N515 N529 {Cparallel}
D221 N515 N529 diode1
R442 N515 N529 {Rshunt}
R443 N497 N515 {Rseries}
I222 N498 N531 {Isource}
C222 N531 N498 {Cparallel}
D222 N531 N498 diode1
R444 N531 N498 {Rshunt}
R445 N530 N531 {Rseries}
I223 N532 N516 {Isource}
C223 N516 N532 {Cparallel}
D223 N516 N532 diode1
R446 N516 N532 {Rshunt}
R447 N500 N516 {Rseries}
I224 N501 N534 {Isource}
C224 N534 N501 {Cparallel}
D224 N534 N501 diode1
R448 N534 N501 {Rshunt}
R449 N533 N534 {Rseries}
I225 N497 N483 {Isource}
C225 N483 N497 {Cparallel}
D225 N483 N497 diode1
R450 N483 N497 {Rshunt}
R451 N465 N483 {Rseries}
I226 N466 N499 {Isource}
C226 N499 N466 {Cparallel}
D226 N499 N466 diode1
R452 N499 N466 {Rshunt}
R453 N498 N499 {Rseries}
I227 N500 N484 {Isource}
C227 N484 N500 {Cparallel}
D227 N484 N500 diode1
R454 N484 N500 {Rshunt}
R455 N468 N484 {Rseries}
I228 N469 N502 {Isource}
C228 N502 N469 {Cparallel}
D228 N502 N469 diode1
R456 N502 N469 {Rshunt}
R457 N501 N502 {Rseries}
I229 N465 N451 {Isource}
C229 N451 N465 {Cparallel}
D229 N451 N465 diode1
R458 N451 N465 {Rshunt}
R459 N433 N451 {Rseries}
I230 N434 N467 {Isource}
C230 N467 N434 {Cparallel}
D230 N467 N434 diode1
R460 N467 N434 {Rshunt}
R461 N466 N467 {Rseries}
I231 N468 N452 {Isource}
C231 N452 N468 {Cparallel}
D231 N452 N468 diode1
R462 N452 N468 {Rshunt}
R463 N436 N452 {Rseries}
I232 N437 N470 {Isource}
C232 N470 N437 {Cparallel}
D232 N470 N437 diode1
R464 N470 N437 {Rshunt}
R465 N469 N470 {Rseries}
I233 N433 N419 {Isource}
C233 N419 N433 {Cparallel}
D233 N419 N433 diode1
R466 N419 N433 {Rshunt}
R467 N401 N419 {Rseries}
I234 N402 N435 {Isource}
C234 N435 N402 {Cparallel}
D234 N435 N402 diode1
R468 N435 N402 {Rshunt}
R469 N434 N435 {Rseries}
I235 N436 N420 {Isource}
C235 N420 N436 {Cparallel}
D235 N420 N436 diode1
R470 N420 N436 {Rshunt}
R471 N404 N420 {Rseries}
I236 N405 N438 {Isource}
C236 N438 N405 {Cparallel}
D236 N438 N405 diode1
R472 N438 N405 {Rshunt}
R473 N437 N438 {Rseries}
I237 N401 N387 {Isource}
C237 N387 N401 {Cparallel}
D237 N387 N401 diode1
R474 N387 N401 {Rshunt}
R475 N369 N387 {Rseries}
I238 N370 N403 {Isource}
C238 N403 N370 {Cparallel}
D238 N403 N370 diode1
R476 N403 N370 {Rshunt}
R477 N402 N403 {Rseries}
I239 N404 N388 {Isource}
C239 N388 N404 {Cparallel}
D239 N388 N404 diode1
R478 N388 N404 {Rshunt}
R479 N372 N388 {Rseries}
I240 N373 N406 {Isource}
C240 N406 N373 {Cparallel}
D240 N406 N373 diode1
R480 N406 N373 {Rshunt}
R481 N405 N406 {Rseries}
I241 N369 N355 {Isource}
C241 N355 N369 {Cparallel}
D241 N355 N369 diode1
R482 N355 N369 {Rshunt}
R483 N337 N355 {Rseries}
I242 N338 N371 {Isource}
C242 N371 N338 {Cparallel}
D242 N371 N338 diode1
R484 N371 N338 {Rshunt}
R485 N370 N371 {Rseries}
I243 N372 N356 {Isource}
C243 N356 N372 {Cparallel}
D243 N356 N372 diode1
R486 N356 N372 {Rshunt}
R487 N340 N356 {Rseries}
I244 N341 N374 {Isource}
C244 N374 N341 {Cparallel}
D244 N374 N341 diode1
R488 N374 N341 {Rshunt}
R489 N373 N374 {Rseries}
I245 N337 N323 {Isource}
C245 N323 N337 {Cparallel}
D245 N323 N337 diode1
R490 N323 N337 {Rshunt}
R491 N305 N323 {Rseries}
I246 N306 N339 {Isource}
C246 N339 N306 {Cparallel}
D246 N339 N306 diode1
R492 N339 N306 {Rshunt}
R493 N338 N339 {Rseries}
I247 N340 N324 {Isource}
C247 N324 N340 {Cparallel}
D247 N324 N340 diode1
R494 N324 N340 {Rshunt}
R495 N308 N324 {Rseries}
I248 N309 N342 {Isource}
C248 N342 N309 {Cparallel}
D248 N342 N309 diode1
R496 N342 N309 {Rshunt}
R497 N341 N342 {Rseries}
I249 N305 N291 {Isource}
C249 N291 N305 {Cparallel}
D249 N291 N305 diode1
R498 N291 N305 {Rshunt}
R499 N273 N291 {Rseries}
I250 N274 N307 {Isource}
C250 N307 N274 {Cparallel}
D250 N307 N274 diode1
R500 N307 N274 {Rshunt}
R501 N306 N307 {Rseries}
I251 N308 N292 {Isource}
C251 N292 N308 {Cparallel}
D251 N292 N308 diode1
R502 N292 N308 {Rshunt}
R503 N276 N292 {Rseries}
I252 N277 N310 {Isource}
C252 N310 N277 {Cparallel}
D252 N310 N277 diode1
R504 N310 N277 {Rshunt}
R505 N309 N310 {Rseries}
I253 N273 N259 {Isource}
C253 N259 N273 {Cparallel}
D253 N259 N273 diode1
R506 N259 N273 {Rshunt}
R507 N241 N259 {Rseries}
I254 N242 N275 {Isource}
C254 N275 N242 {Cparallel}
D254 N275 N242 diode1
R508 N275 N242 {Rshunt}
R509 N274 N275 {Rseries}
I255 N276 N260 {Isource}
C255 N260 N276 {Cparallel}
D255 N260 N276 diode1
R510 N260 N276 {Rshunt}
R511 N244 N260 {Rseries}
I256 N245 N278 {Isource}
C256 N278 N245 {Cparallel}
D256 N278 N245 diode1
R512 N278 N245 {Rshunt}
R513 N277 N278 {Rseries}
I257 N241 N227 {Isource}
C257 N227 N241 {Cparallel}
D257 N227 N241 diode1
R514 N227 N241 {Rshunt}
R515 N209 N227 {Rseries}
I258 N210 N243 {Isource}
C258 N243 N210 {Cparallel}
D258 N243 N210 diode1
R516 N243 N210 {Rshunt}
R517 N242 N243 {Rseries}
I259 N244 N228 {Isource}
C259 N228 N244 {Cparallel}
D259 N228 N244 diode1
R518 N228 N244 {Rshunt}
R519 N212 N228 {Rseries}
I260 N213 N246 {Isource}
C260 N246 N213 {Cparallel}
D260 N246 N213 diode1
R520 N246 N213 {Rshunt}
R521 N245 N246 {Rseries}
I261 N209 N195 {Isource}
C261 N195 N209 {Cparallel}
D261 N195 N209 diode1
R522 N195 N209 {Rshunt}
R523 N177 N195 {Rseries}
I262 N178 N211 {Isource}
C262 N211 N178 {Cparallel}
D262 N211 N178 diode1
R524 N211 N178 {Rshunt}
R525 N210 N211 {Rseries}
I263 N212 N196 {Isource}
C263 N196 N212 {Cparallel}
D263 N196 N212 diode1
R526 N196 N212 {Rshunt}
R527 N180 N196 {Rseries}
I264 N181 N214 {Isource}
C264 N214 N181 {Cparallel}
D264 N214 N181 diode1
R528 N214 N181 {Rshunt}
R529 N213 N214 {Rseries}
I265 N177 N163 {Isource}
C265 N163 N177 {Cparallel}
D265 N163 N177 diode1
R530 N163 N177 {Rshunt}
R531 N145 N163 {Rseries}
I266 N146 N179 {Isource}
C266 N179 N146 {Cparallel}
D266 N179 N146 diode1
R532 N179 N146 {Rshunt}
R533 N178 N179 {Rseries}
I267 N180 N164 {Isource}
C267 N164 N180 {Cparallel}
D267 N164 N180 diode1
R534 N164 N180 {Rshunt}
R535 N148 N164 {Rseries}
I268 N149 N182 {Isource}
C268 N182 N149 {Cparallel}
D268 N182 N149 diode1
R536 N182 N149 {Rshunt}
R537 N181 N182 {Rseries}
I269 N145 N131 {Isource}
C269 N131 N145 {Cparallel}
D269 N131 N145 diode1
R538 N131 N145 {Rshunt}
R539 N113 N131 {Rseries}
I270 N114 N147 {Isource}
C270 N147 N114 {Cparallel}
D270 N147 N114 diode1
R540 N147 N114 {Rshunt}
R541 N146 N147 {Rseries}
I271 N148 N132 {Isource}
C271 N132 N148 {Cparallel}
D271 N132 N148 diode1
R542 N132 N148 {Rshunt}
R543 N116 N132 {Rseries}
I272 N117 N150 {Isource}
C272 N150 N117 {Cparallel}
D272 N150 N117 diode1
R544 N150 N117 {Rshunt}
R545 N149 N150 {Rseries}
I273 N113 N099 {Isource}
C273 N099 N113 {Cparallel}
D273 N099 N113 diode1
R546 N099 N113 {Rshunt}
R547 N081 N099 {Rseries}
I274 N082 N115 {Isource}
C274 N115 N082 {Cparallel}
D274 N115 N082 diode1
R548 N115 N082 {Rshunt}
R549 N114 N115 {Rseries}
I275 N116 N100 {Isource}
C275 N100 N116 {Cparallel}
D275 N100 N116 diode1
R550 N100 N116 {Rshunt}
R551 N084 N100 {Rseries}
I276 N085 N118 {Isource}
C276 N118 N085 {Cparallel}
D276 N118 N085 diode1
R552 N118 N085 {Rshunt}
R553 N117 N118 {Rseries}
I277 N081 N067 {Isource}
C277 N067 N081 {Cparallel}
D277 N067 N081 diode1
R554 N067 N081 {Rshunt}
R555 N049 N067 {Rseries}
I278 N050 N083 {Isource}
C278 N083 N050 {Cparallel}
D278 N083 N050 diode1
R556 N083 N050 {Rshunt}
R557 N082 N083 {Rseries}
I279 N084 N068 {Isource}
C279 N068 N084 {Cparallel}
D279 N068 N084 diode1
R558 N068 N084 {Rshunt}
R559 N052 N068 {Rseries}
I280 N053 N086 {Isource}
C280 N086 N053 {Cparallel}
D280 N086 N053 diode1
R560 N086 N053 {Rshunt}
R561 N085 N086 {Rseries}
I281 N049 N035 {Isource}
C281 N035 N049 {Cparallel}
D281 N035 N049 diode1
R562 N035 N049 {Rshunt}
R563 N017 N035 {Rseries}
I282 N018 N051 {Isource}
C282 N051 N018 {Cparallel}
D282 N051 N018 diode1
R564 N051 N018 {Rshunt}
R565 N050 N051 {Rseries}
I283 N052 N036 {Isource}
C283 N036 N052 {Cparallel}
D283 N036 N052 diode1
R566 N036 N052 {Rshunt}
R567 N020 N036 {Rseries}
I284 N021 N054 {Isource}
C284 N054 N021 {Cparallel}
D284 N054 N021 diode1
R568 N054 N021 {Rshunt}
R569 N053 N054 {Rseries}
I285 N017 N001 {Isource}
C285 N001 N017 {Cparallel}
D285 N001 N017 diode1
R570 N001 N017 {Rshunt}
R571 N002 N001 {Rseries}
I286 N002 N019 {Isource}
C286 N019 N002 {Cparallel}
D286 N019 N002 diode1
R572 N019 N002 {Rshunt}
R573 N018 N019 {Rseries}
I287 N020 N003 {Isource}
C287 N003 N020 {Cparallel}
D287 N003 N020 diode1
R574 N003 N020 {Rshunt}
R575 N004 N003 {Rseries}
I288 N004 N022 {Isource}
C288 N022 N004 {Cparallel}
D288 N022 N004 diode1
R576 N022 N004 {Rshunt}
R577 N021 N022 {Rseries}
.model D D
.lib standard.dio
.model NMOS NMOS
.model PMOS PMOS
.lib standard.mos
.model diode1 D(IS=4e-6 N=1.65)
.tran 500u
.param Rshunt = 833
.param Rseries = 333u
.param Isource = 10
.param Cparallel = 12u
.model mos1 VDMOS(Rg=3 Vto=1.7 Rd=8m Rs=6m Rb=10m Kp=70 Cgdmax=2.5n Cgdmin=.4n Cgs=2n Cjo=1n Is=80p Vds=100 Ron=20m Qg=40n)
.backanno
.end